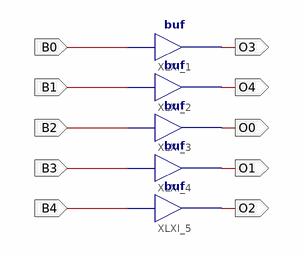
[diagram p0: schematic sheet 1]
// Xilinx ISE schematic LS2.sch (xc9500xl) as structural Verilog: 5 symbols, 10 ports
module LS2 (
  input  B0,
  input  B1,
  input  B2,
  input  B3,
  input  B4,
  output O3,
  output O4,
  output O0,
  output O1,
  output O2
);

  buf XLXI_1 (O3, B0);
  buf XLXI_2 (O4, B1);
  buf XLXI_3 (O0, B2);
  buf XLXI_4 (O1, B3);
  buf XLXI_5 (O2, B4);
endmodule
